# Altium schematic sheet motor_control.SchDoc
size A4; DocumentNumber: 5; SheetNumber: 5; SheetTotal: 11
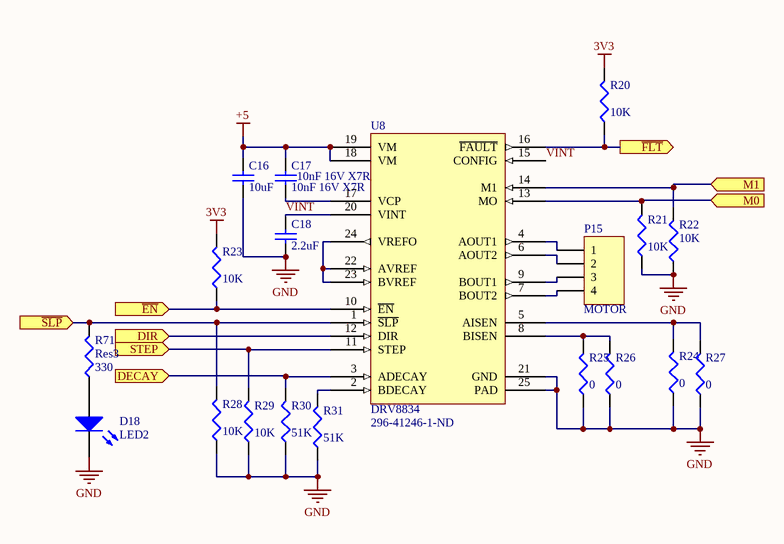
[diagram p0: motor_control.SchDoc]

## Parts
C16  10uF  [1608[0603]]
C17  10nF 16V X7R  [1608[0603]]
C18  2.2uF  [1608[0603]]
D18  LED2  [0603-LED]
P15  MOTOR  [DF14-4P-1.25H(55)]
R20  10K  [J1-0603]
R21  10K  [J1-0603]
R22  10K  [J1-0603]
R23  10K  [J1-0603]
R24  0  [J1-0603]
R25  0  [J1-0603]
R26  0  [J1-0603]
R27  0  [J1-0603]
R28  10K  [J1-0603]
R29  10K  [J1-0603]
R30  51K  [J1-0603]
R31  51K  [J1-0603]
R71  Res3  value 330  [J1-0603]
U8  DRV8834  Supplier Part Number 1: 296-41246-1-ND  [SOP65P640X120-25N]

## Ports
DECAY (in), DIR (in), M0 (in), M1 (in), STEP (in), ~{EN} (in), ~{FLT} (out), ~{SLP} (in)

## Nets
3V3: R20.2 R23.2
+5: C16.2 C17.2 U8.18(VM) U8.19(VM)
GND: C16.1 C18.1 D18.2(K) R21.1 R22.1 R24.1 R25.1 R26.1 R27.1 R28.1 R29.1 R30.1 R31.1 U8.21(GND) U8.25(PAD)
DECAY: R30.2 U8.3(ADECAY) ; port DECAY
DIR: U8.12(DIR) ; port DIR
~{EN}: R23.1 U8.10(~{EN}) ; port ~{EN}
~{FLT}: R20.1 U8.16(~{FAULT}) ; port ~{FLT}
M0: R21.2 U8.13(MO) ; port M0
M1: R22.2 U8.14(M1) ; port M1
~{SLP}: R28.2 R71.2 U8.1(~{SLP}) ; port ~{SLP}
STEP: R29.2 U8.11(STEP) ; port STEP
VINT: C18.2 U8.15(CONFIG) U8.20(VINT)
NetC17_1: C17.1 U8.17(VCP)
NetD18_1: D18.1(A) R71.1
NetP15_1: P15.1 U8.4(AOUT1)
NetP15_2: P15.2 U8.6(AOUT2)
NetP15_3: P15.3 U8.9(BOUT1)
NetP15_4: P15.4 U8.7(BOUT2)
NetR24_2: R24.2 R27.2 U8.5(AISEN)
NetR25_2: R25.2 R26.2 U8.8(BISEN)
NetR31_2: R31.2 U8.2(BDECAY)
NetU8_22: U8.22(AVREF) U8.23(BVREF) U8.24(VREFO)

## Notes on the sheet
- (near U8) Logic high enables indexer mode
- When voltage on these pins is >0.5 V outputs are turned off
- Calculations in datasheet for placing small current sense resistors here for current limiting.
  Parallel to increase heat sinking capability. Should be properly rated.

## Library data of the parts
C16-C18 = Cap Semi: Capacitor (Semiconductor SIM Model); Published: 8-Jun-2000; LatestRevisionDate: 29-May-2009; LatestRevisionNote: IPC-7351 Footprint Added.; PackageReference: C1206; Publisher: Altium Limited; PackageDescription: Chip Capacitor; Supplier: Digi-Key
  C16: Value: 10uF; Supplier Part Number: 587-3258-1-ND
  C17: Value: 10nF 16V X7R; Supplier Part Number: 587-2708-1-ND
  C18: Value: 2.2uF; Supplier Part Number: 1276-1085-1-ND
D18 = LED2: Typical RED, GREEN, YELLOW, AMBER GaAs LED; Published: 8-Jun-2000; LatestRevisionDate: 17-Jul-2002; LatestRevisionNote: Re-released for DXP Platform.; PackageVersion: Feb-2002; PackageReference: 3.2X1.6X1.1; Publisher: Altium Limited; PackageDescription: SM LED; 2 Flat Leads
P15 = Header 4: Header, 4-Pin; LatestRevisionDate: 17-Jul-2002; LatestRevisionNote: Re-released for DXP Platform.; Publisher: Altium Limited; Supplier: Digi-Key
R20-R31 R71 = Res3: Resistor; Published: 8-Jun-2000; LatestRevisionDate: 29-May-2009; LatestRevisionNote: IPC-7351 Footprint Added.; PackageReference: J1-0603; Publisher: Altium Limited; PackageDescription: Chip Resistor
  R20-R23 R28 R29: Value: 10K; Supplier: Digi-Key
  R24-R27: Value: 0; Supplier: Digi-Key
  R30 R31: Value: 51K; Supplier: Digi-Key
U8 = DRV8834: Dual-bridge stepper or dc motor driver. 1.5A per coil with 2.5-10.8 V load supply.; Supplier 1: Digi-Key; Supplier: Digi-Key